# Altium schematic sheet ADS1292R_ECG_Module.SchDoc: X
size A3; Date: DD-MM-YYYY; CheckedBy: X; DrawnBy: Y; Revision: 0.0.0; SheetNumber: X; SheetTotal: Y; Projectnumber: OWN-000; Size: A4; Projectname: X
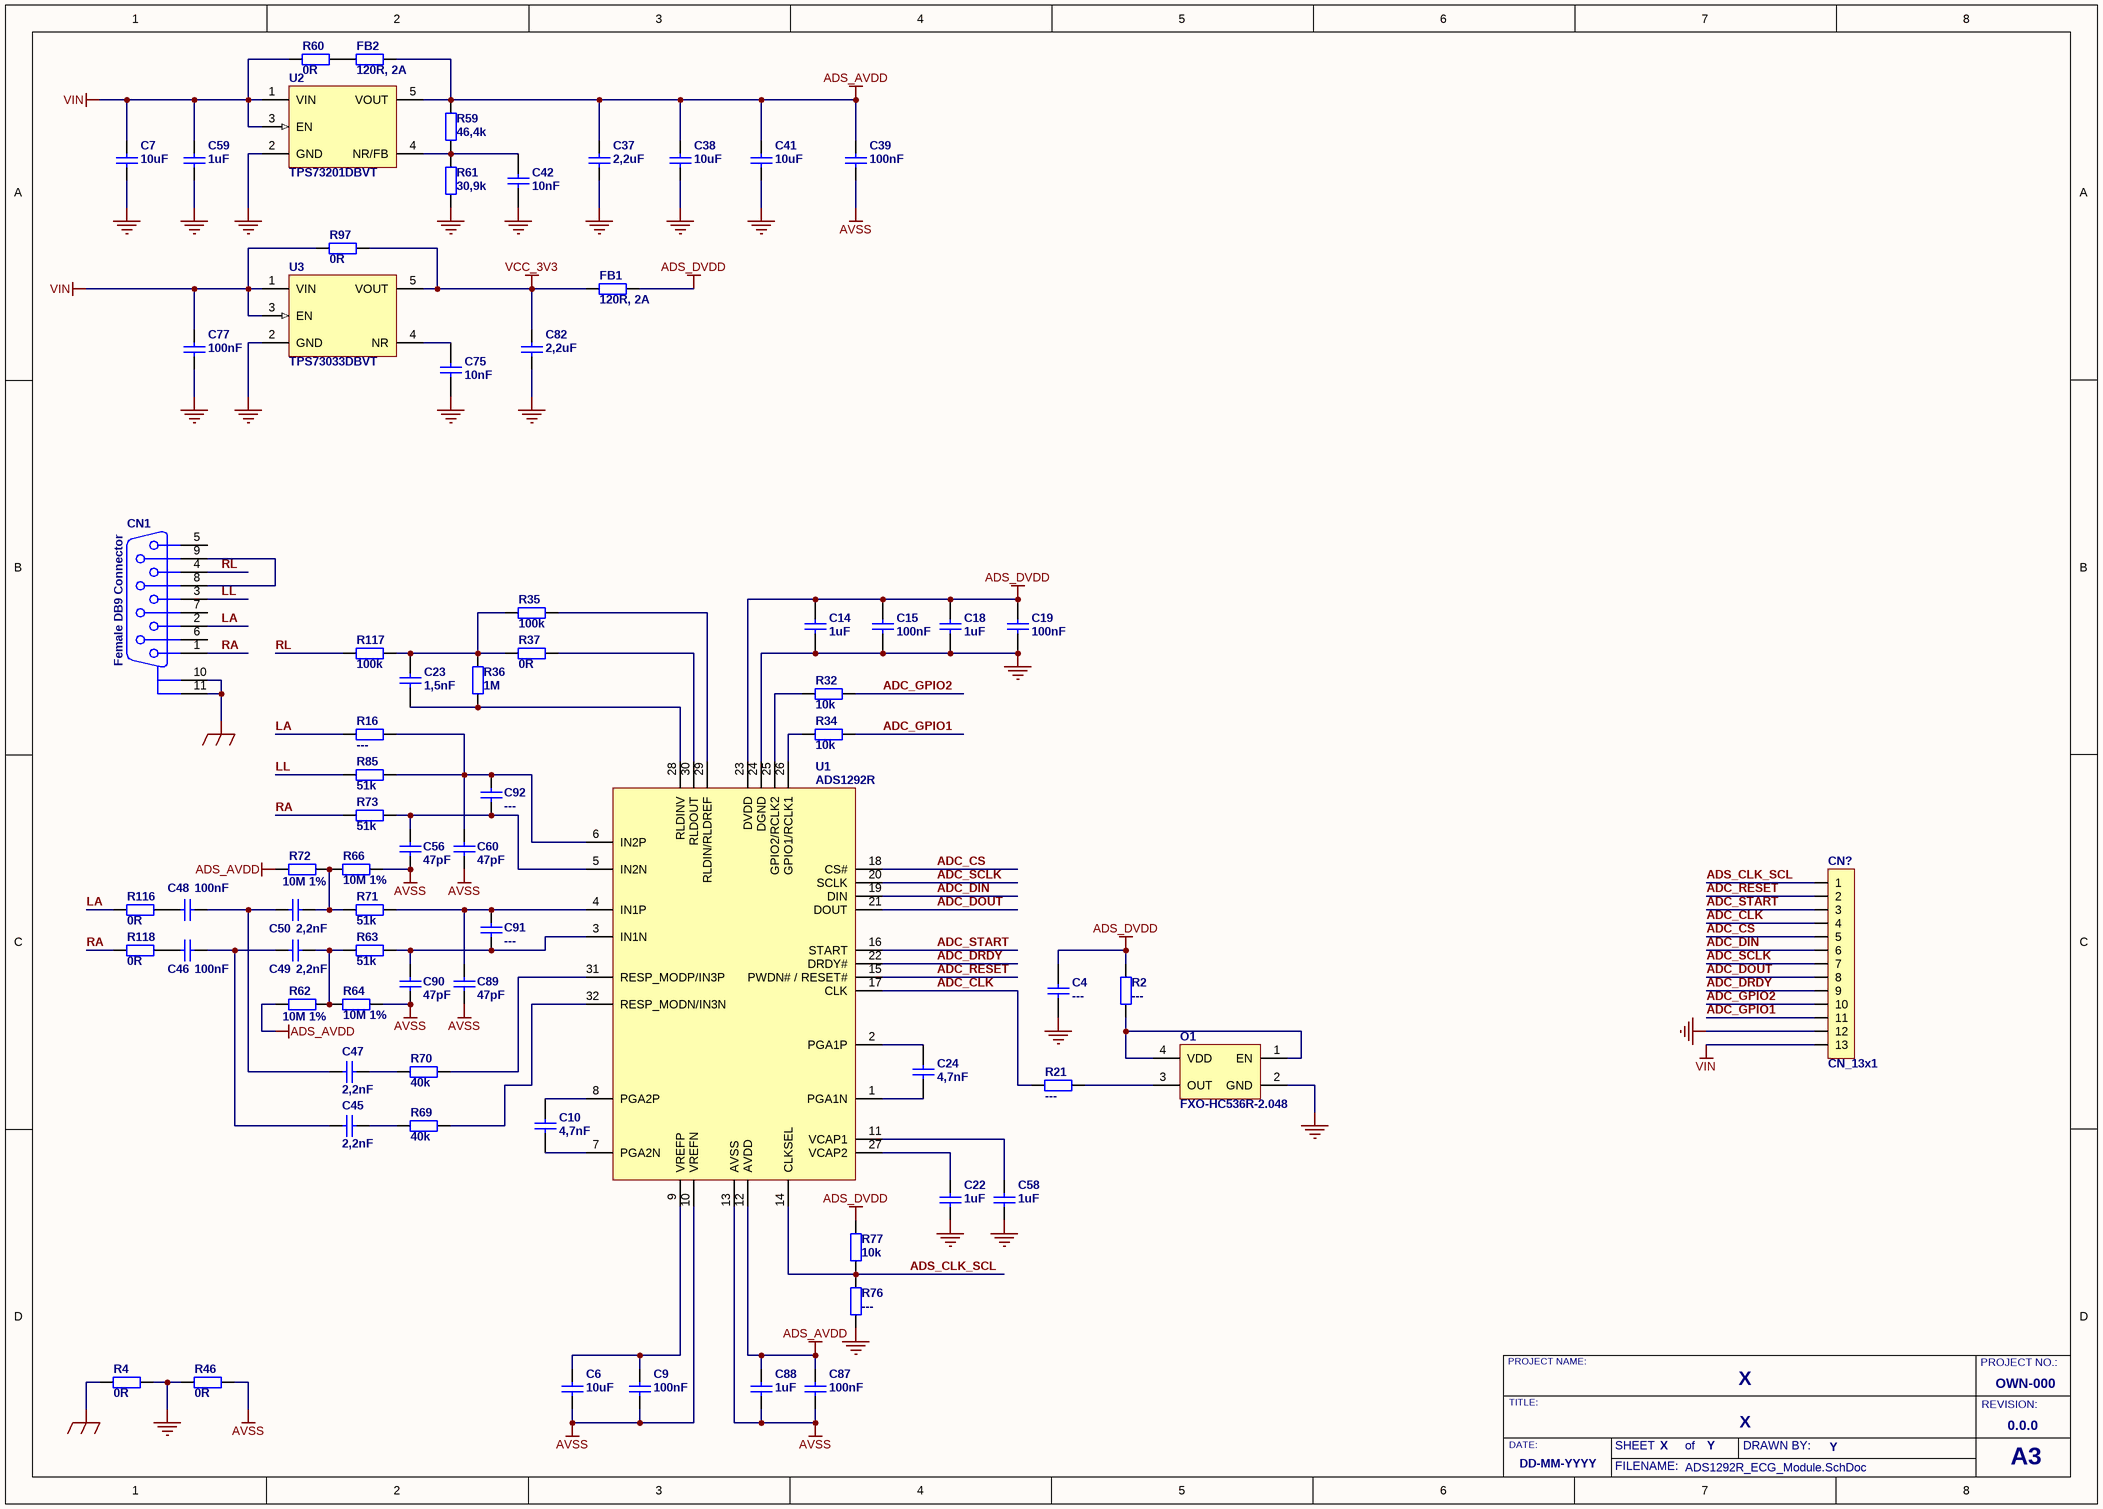
[diagram p0: ADS1292R_ECG_Module.SchDoc]

## Parts
C4  ---  [C0603]
C6  10uF  [C0603]
C7  10uF  [C0603]
C9  100nF  [C0603]
C10  4,7nF  [C0603]
C14  1uF  [C0603]
C15  100nF  [C0603]
C18  1uF  [C0603]
C19  100nF  [C0603]
C22  1uF  [C0603]
C23  1,5nF  [C0603]
C24  4,7nF  [C0603]
C37  2,2uF  [C0603]
C38  10uF  [C0603]
C39  100nF  [C0603]
C41  10uF  [C0603]
C42  10nF  [C0603]
C45  2,2nF  [C0603]
C46  100nF  [C0603]
C47  2,2nF  [C0603]
C48  100nF  [C0603]
C49  2,2nF  [C0603]
C50  2,2nF  [C0603]
C56  47pF  [C0603]
C58  1uF  [C0603]
C59  1uF  [C0603]
C60  47pF  [C0603]
C75  10nF  [C0603]
C77  100nF  [C0603]
C82  2,2uF  [C0603]
C87  100nF  [C0603]
C88  1uF  [C0603]
C89  47pF  [C0603]
C90  47pF  [C0603]
C91  ---  [C0603]
C92  ---  [C0603]
CN1  Female DB9 Connector  [DSUB9H-7,2mm-FEMALE]
CN?  CN_13x1  [GP_13x1H]
FB1  120R, 2A  [FB0603]
FB2  120R, 2A  [FB0603]
O1  FXO-HC536R-2.048  [FXO-HC536R_M]
R2  ---  [R0603]
R4  0R  [R0603]
R16  ---  [R0603]
R21  ---  [R0603]
R32  10k  [R0603]
R34  10k  [R0603]
R35  100k  [R0603]
R36  1M  [R0603]
R37  0R  [R0603]
R46  0R  [R0603]
R59  46,4k  [R0603]
R60  0R  [R0603]
R61  30,9k  [R0603]
R62  10M 1%  [R0603]
R63  51k  [R0603]
R64  10M 1%  [R0603]
R66  10M 1%  [R0603]
R69  40k  [R0603]
R70  40k  [R0603]
R71  51k  [R0603]
R72  10M 1%  [R0603]
R73  51k  [R0603]
R76  ---  [R0603]
R77  10k  [R0603]
R85  51k  [R0603]
R97  0R  [R0603]
R116  0R  [R0603]
R117  100k  [R0603]
R118  0R  [R0603]
U1  ADS1292R  [TSQFP50P700X700X105-32N]
U2  TPS73201DBVT  [SOT-23-5]
U3  TPS73033DBVT  [SOT-23-5]

## Nets
ADS_AVDD: C37.2 C38.2 C39.2 C41.2 C87.2 C88.2 FB2.2 R59.2 R62.1 R72.1 U1.12(AVDD) U2.5(VOUT)
ADS_DVDD: C4.2 C14.2 C15.2 C18.2 C19.2 FB1.2 R2.1 R77.1 U1.23(DVDD)
AVSS: C6.1 C9.1 C39.1 C56.1 C60.1 C87.1 C88.1 C89.1 C90.1 R46.1 R64.2 R66.2 U1.10(VREFN) U1.13(AVSS)
EARTH: CN1.10(MH1) CN1.11(MH2) R4.2
GND: C4.1 C7.1 C14.1 C15.1 C18.1 C19.1 C22.1 C37.1 C38.1 C41.1 C42.1 C58.1 C59.1 C75.1 C77.1 C82.1 CN?.12 O1.2(GND) R4.1 R46.2 R61.1 R76.2 U1.24(DGND) U2.2(GND) U3.2(GND)
VCC_3V3: C82.2 FB1.1 R97.1 U3.5(VOUT)
VIN: C7.2 C59.2 C77.2 CN?.13 R60.2 R97.2 U2.1(VIN) U2.3(EN) U3.1(VIN) U3.3(EN)
ADC_CLK: CN?.4 R21.2 U1.17(CLK)
ADC_CS: CN?.5 U1.18(CS#)
ADC_DIN: CN?.6 U1.19(DIN)
ADC_DOUT: CN?.8 U1.21(DOUT)
ADC_DRDY: CN?.9 U1.22(DRDY#)
ADC_GPIO1: CN?.11 R34.1
ADC_GPIO2: CN?.10 R32.1
ADC_RESET: CN?.2 U1.15(PWDN#_/_RESET#)
ADC_SCLK: CN?.7 U1.20(SCLK)
ADC_START: CN?.3 U1.16(START)
ADS_CLK_SCL: CN?.1 R76.1 R77.2 U1.14(CLKSEL)
LA: CN1.2 R16.1 R116.1
LL: CN1.3 R85.1
RA: CN1.1 R73.1 R118.1
RL: CN1.4 R117.1
NetC6_2: C6.2 C9.2 U1.9(VREFP)
NetC10_1: C10.1 U1.7(PGA2N)
NetC10_2: C10.2 U1.8(PGA2P)
NetC22_2: C22.2 U1.27(VCAP2)
NetC23_1: C23.1 R35.2 R36.1 R37.2 R117.2
NetC23_2: C23.2 R36.2 U1.28(RLDINV)
NetC24_1: C24.1 U1.1(PGA1N)
NetC24_2: C24.2 U1.2(PGA1P)
NetC42_2: C42.2 R59.1 R61.2 U2.4(NR/FB)
NetC45_1: C45.1 C46.2 C49.1
NetC45_2: C45.2 R69.1
NetC46_1: C46.1 R118.2
NetC47_1: C47.1 C48.2 C50.1
NetC47_2: C47.2 R70.1
NetC48_1: C48.1 R116.2
NetC49_2: C49.2 R62.2 R63.1 R64.1
NetC50_2: C50.2 R66.1 R71.1 R72.2
NetC56_2: C56.2 C92.1 R73.2 U1.5(IN2N)
NetC58_2: C58.2 U1.11(VCAP1)
NetC60_2: C60.2 C92.2 R16.2 R85.2 U1.6(IN2P)
NetC75_2: C75.2 U3.4(NR)
NetC89_2: C89.2 C91.2 R71.2 U1.4(IN1P)
NetC90_2: C90.2 C91.1 R63.2 U1.3(IN1N)
NetCN1_8: CN1.8 CN1.9
NetFB2_1: FB2.1 R60.1
NetO1_1: O1.1(EN) O1.4(VDD) R2.2
NetO1_3: O1.3(OUT) R21.1
NetR32_2: R32.2 U1.25(GPIO2/RCLK2)
NetR34_2: R34.2 U1.26(GPIO1/RCLK1)
NetR35_1: R35.1 U1.29(RLDIN/RLDREF)
NetR37_1: R37.1 U1.30(RLDOUT)
NetR69_2: R69.2 U1.32(RESP_MODN/IN3N)
NetR70_2: R70.2 U1.31(RESP_MODP/IN3P)

Not connected (* = marked no-connect by the designer): CN1 5 6 7

## Notes on the sheet
- PROJECT NAME:
- PROJECT NO.:
- DATE:
- TITLE:
- SHEET
- of
- DRAWN BY:
- REVISION:
- FILENAME:
- A3

## Library data of the parts
C4 C6 C7 C9 C10 C14 C15 C18 C19 C22-C24 C37-C39 C41 C42 C45-C50 C56 C58-C60 C75 C77 C82 C87-C92 = Cap: Capacitor; ComponentLink1Description: datasheet; ComponentLink2Description: supplier
  C4 C91 C92: Value: ---
  C6 C7 C38 C41: Value: 10uF
  C9 C15 C19 C39 C46 C48 C77 C87: Value: 100nF
  C10 C24: Value: 4,7nF
  C14 C18 C22 C58 C59 C88: Value: 1uF
  C23: Value: 1,5nF
  C37 C82: Value: 2,2uF
  C42 C75: Value: 10nF
  C45 C47 C49 C50: Value: 2,2nF
  C56 C60 C89 C90: Value: 47pF
CN1 = DB9F_WGND
FB1 FB2 = BLM18PG121SN1D: Ferrite Bead; Imp.@ 100MHz:120R; Mounting: SMD; 2A; Case: 0603; Published: 19-Feb-2006; ComponentLink1Description: datasheet; ComponentLink2Description: supplier; Supplier 1: TME; Supplier Part Number 1: BLM18PG121SN1D; Value: 120R, 2A
O1 = FXO-HC536R-2.048: Fox Electronics, 2.048MHZ, 3.2x5mm, SMD Oscillator
R2 R4 R16 R21 R32 R34-R37 R46 R59-R64 R66 R69-R73 R76 R77 R85 R97 R116-R118 = Res: Resistor; Published: 19-Feb-2006; ComponentLink1Description: datasheet; ComponentLink2Description: supplier
  R2 R16 R21 R76: Value: ---
  R4 R37 R46 R60 R97 R116 R118: Value: 0R
  R32 R34 R77: Value: 10k
  R35 R117: Value: 100k
  R36: Value: 1M
  R59: Value: 46,4k
  R61: Value: 30,9k
  R62 R64 R66 R72: Value: 10M 1%
  R63 R71 R73 R85: Value: 51k
  R69 R70: Value: 40k
U1 = ADS1292R: Low-Power, 2-Channel, 24-Bit Analog Front-End for Biopotential Measurements
U2 = TPS73201DBVT: Single Output LDO, 250mA, Adj.(1.2 to 5.5V), Low Noise, Fast Transient Response; Supplier 1: Farnell; Supplier Part Number 1: 1207342
U3 = TPS73033DBVT: Single Output LDO, 3V3@250mA, Low Noise, High PSSR; Supplier 1: TME; Supplier 2: Farnell; Supplier Part Number 1: TPS73033DBVT; Supplier Part Number 2: 1135395
CN? = CN_13x1: Published: 8-Jun-2000